# EAGLE design GCtoUSB_Current (EAGLE 6.2)
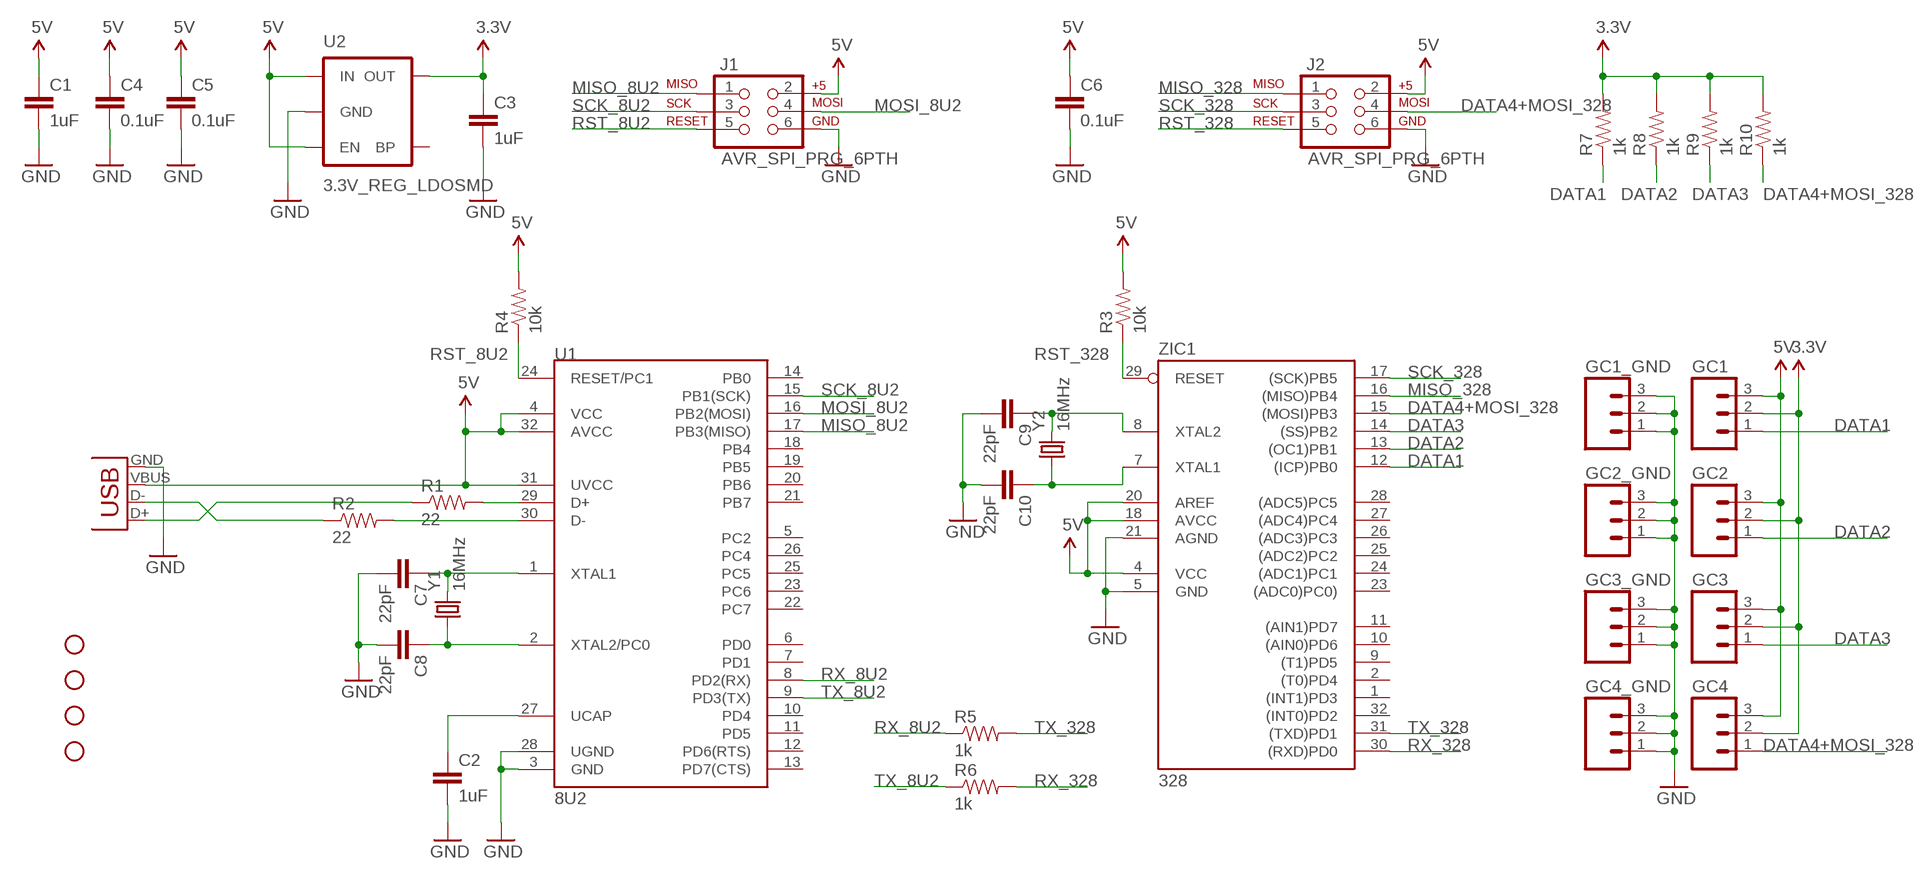
[diagram p0: schematic, sheet 1]

## Parts
C1  1uF  CAP0402-CAP  [0402-CAP]
C2  1uF  CAP0402-CAP  [0402-CAP]
C3  1uF  CAP0402-CAP  [0402-CAP]
C4  0.1uF  CAP0402-CAP  [0402-CAP]
C5  0.1uF  CAP0402-CAP  [0402-CAP]
C6  0.1uF  CAP0402-CAP  [0402-CAP]
C7  22pF  CAP0402-CAP  [0402-CAP]
C8  22pF  CAP0402-CAP  [0402-CAP]
C9  22pF  CAP0402-CAP  [0402-CAP]
C10  22pF  CAP0402-CAP  [0402-CAP]
GC1  M031X03_NO_SILK  [1X03_NO_SILK]
GC1_GND  M031X03_NO_SILK  [1X03_NO_SILK]
GC2  M031X03_NO_SILK  [1X03_NO_SILK]
GC2_GND  M031X03_NO_SILK  [1X03_NO_SILK]
GC3  M031X03_NO_SILK  [1X03_NO_SILK]
GC3_GND  M031X03_NO_SILK  [1X03_NO_SILK]
GC4  M031X03_NO_SILK  [1X03_NO_SILK]
GC4_GND  M031X03_NO_SILK  [1X03_NO_SILK]
J1  AVR_SPI_PRG_6PTH  [2X3]
J2  AVR_SPI_PRG_6PTH  [2X3]
JP5  STAND-OFF  [STAND-OFF]
JP6  STAND-OFF  [STAND-OFF]
JP7  STAND-OFF  [STAND-OFF]
JP8  STAND-OFF  [STAND-OFF]
R1  22  RESISTOR0603-RES  [0603-RES]
R2  22  RESISTOR0603-RES  [0603-RES]
R3  10k  RESISTOR0603-RES  [0603-RES]
R4  10k  RESISTOR0603-RES  [0603-RES]
R5  1k  RESISTOR0603-RES  [0603-RES]
R6  1k  RESISTOR0603-RES  [0603-RES]
R7  1k  RESISTOR0603-RES  [0603-RES]
R8  1k  RESISTOR0603-RES  [0603-RES]
R9  1k  RESISTOR0603-RES  [0603-RES]
R10  1k  RESISTOR0603-RES  [0603-RES]
U1  8U2  ATMEGA8U2AU  [TQFP32-08]
U2  3.3V_REG_LDOSMD  V_REG_LDOSMD  [SOT23-5]
X1  USB-MB-H  [USB-MB-H]
Y1  16MHz  CRYSTALHC49US  [HC49US]
Y2  16MHz  CRYSTALHC49US  [HC49US]
ZIC1  328  AT90S4433A  [TQFP32-08]

## Nets
3.3V: C3.1 GC1.2 GC2.2 GC3.2 GC4.2 R7.2 R8.2 R9.2 R10.2 U2.5(OUT)
5V: C1.1 C4.1 C5.1 C6.1 GC1.3 GC2.3 GC3.3 GC4.3 J1.2 J2.2 R3.2 R4.2 U1.4(VCC) U1.31(UVCC) U1.32(AVCC) U2.1(IN) U2.3(EN) X1.VBUS ZIC1.4(VCC) ZIC1.18(AVCC) ZIC1.20(AREF)
DATA1: GC1.1 R7.1 ZIC1.12((ICP)PB0)
DATA2: GC2.1 R8.1 ZIC1.13((OC1)PB1)
DATA3: GC3.1 R9.1 ZIC1.14((SS)PB2)
DATA4+MOSI_328: GC4.1 J2.4 R10.1 ZIC1.15((MOSI)PB3)
GND: C1.2 C2.2 C3.2 C4.2 C5.2 C6.2 C7.2 C8.2 C9.2 C10.2 GC1_GND.1 GC1_GND.2 GC1_GND.3 GC2_GND.1 GC2_GND.2 GC2_GND.3 GC3_GND.1 GC3_GND.2 GC3_GND.3 GC4_GND.1 GC4_GND.2 GC4_GND.3 J1.6 J2.6 U1.3(GND) U1.28(UGND) U2.2(GND) X1.GND ZIC1.5(GND) ZIC1.21(AGND)
MISO_8U2: J1.1 U1.17(PB3(MISO))
MISO_328: J2.1 ZIC1.16((MISO)PB4)
MOSI_8U2: J1.4 U1.16(PB2(MOSI))
N$1: C9.1 Y2.2 ZIC1.8(XTAL2)
N$2: C10.1 Y2.1 ZIC1.7(XTAL1)
N$3: R1.2 U1.29(D+)
N$4: R2.2 U1.30(D-)
N$5: R1.1 X1.D+
N$6: R2.1 X1.D-
N$8: C7.1 U1.1(XTAL1) Y1.2
N$9: C8.1 U1.2(XTAL2/PC0) Y1.1
N$12: C2.1 U1.27(UCAP)
RST_8U2: J1.5 R4.1 U1.24(RESET/PC1)
RST_328: J2.5 R3.1 ZIC1.29(RESET)
RX_8U2: R5.1 U1.8(PD2(RX))
RX_328: R6.2 ZIC1.30((RXD)PD0)
SCK_8U2: J1.3 U1.15(PB1(SCK))
SCK_328: J2.3 ZIC1.17((SCK)PB5)
TX_8U2: R6.1 U1.9(PD3(TX))
TX_328: R5.2 ZIC1.31((TXD)PD1)
Unconnected: U1.5(PC2) U1.6(PD0) U1.7(PD1) U1.10(PD4) U1.11(PD5) U1.12(PD6(RTS)) U1.13(PD7(CTS)) U1.14(PB0) U1.18(PB4) U1.19(PB5) U1.20(PB6) U1.21(PB7) U1.22(PC7) U1.23(PC6) U1.25(PC5) U1.26(PC4) U2.4(BP) ZIC1.1((INT1)PD3) ZIC1.2((T0)PD4) ZIC1.9((T1)PD5) ZIC1.10((AIN0)PD6) ZIC1.11((AIN1)PD7) ZIC1.23((ADC0)PC0)) ZIC1.24((ADC1)PC1) ZIC1.25((ADC2)PC2) ZIC1.26((ADC3)PC3) ZIC1.27((ADC4)PC4) ZIC1.28((ADC5)PC5) ZIC1.32((INT0)PD2)

## Library data of the parts
C1-C10 = SparkFun:CAP: Capacitor Standard 0603 ceramic capacitor, and 0.1" leaded capacitor.
GC1 GC1_GND GC2 GC2_GND GC3 GC3_GND GC4 GC4_GND = SparkFun:M03: Header 3 Standard 3-pin 0.1" header. Use with straight break away headers (SKU : PRT-00116), right angle break away headers (PRT-00553), swiss pins (PRT-00743), machine pins (PRT-00117), and female headers (PRT-00115). Molex polarized connector foot print use with SKU : PRT-08232 with associated crimp pins and housings.
J1 J2 = SparkFun:AVR_SPI_PRG_6: AVR ISP 6 Pin This is the reduced ISP connector for AVR programming. Common on Arduino. This footprint will take up less PCB space and can be used with a 10-pin to 6-pin adapter such as SKU: BOB-08508
JP5-JP8 = SparkFun:STAND-OFF: Stand Off This is the mechanical footprint for a #4 phillips button head screw. Use the keepout ring to avoid running the screw head into surrounding components. SKU : PRT-00447
R1-R10 = SparkFun:RESISTOR: Resistor Basic schematic elements and footprints for 0603, 1206, and PTH resistors.
U1 = SparkFun:ATMEGA8U2: Atmel 8-bit Microcontroller with 8/16/32K Bystes of ISP Flash and USB Controller. ATmega8U2, ATmega16U2, and ATmega32U2
U2 = SparkFun:V_REG_LDO: Voltage Regulator LDO Standard 150mA LDO voltage regulator in SOT-23 layout. Micrel part MIC5205. BP (by-pass) pin is used to lower output noise with 470pF cap.
X1 = SparkFun:USB: USB Connectors USB-B-PTH is fully proven SKU : PRT-00139 USB-miniB is fully proven SKU : PRT-00587 USB-A-PCB is untested. USB-A-H is throughly reviewed, but untested. Spark Fun Electronics SKU : PRT-00437 USB-B-SMT is throughly reviewed, but untested. Needs silkscreen touching up. USB-A-S has not been used/tested USB-MB-H has not been used/tested
Y1 Y2 = SparkFun:CRYSTAL: Crystals Various standard crystals. Proven footprints. Spark Fun Electronics SKU : COM-00534
ZIC1 = atmel:AT90S4433: MICROCONTROLLER 4 Kbytes FLASH 128 bytes SRAM 256 bytes EEPROM UART 6-channel 10 bit ADC

## Net classes
0 default: width 0.203 mm, clearance 0.203 mm

## Board
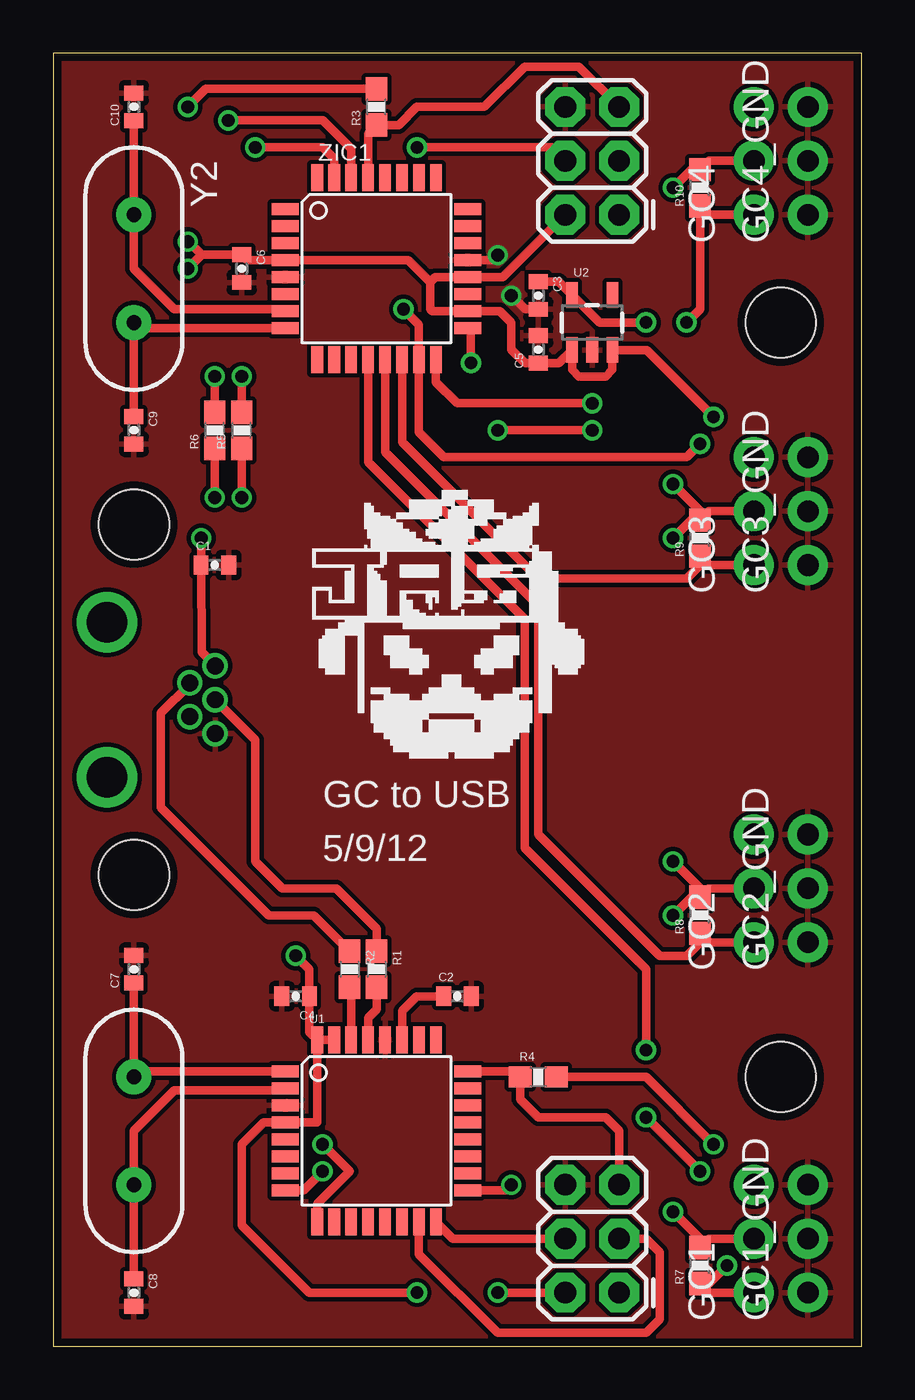
[diagram p1: board, top side]
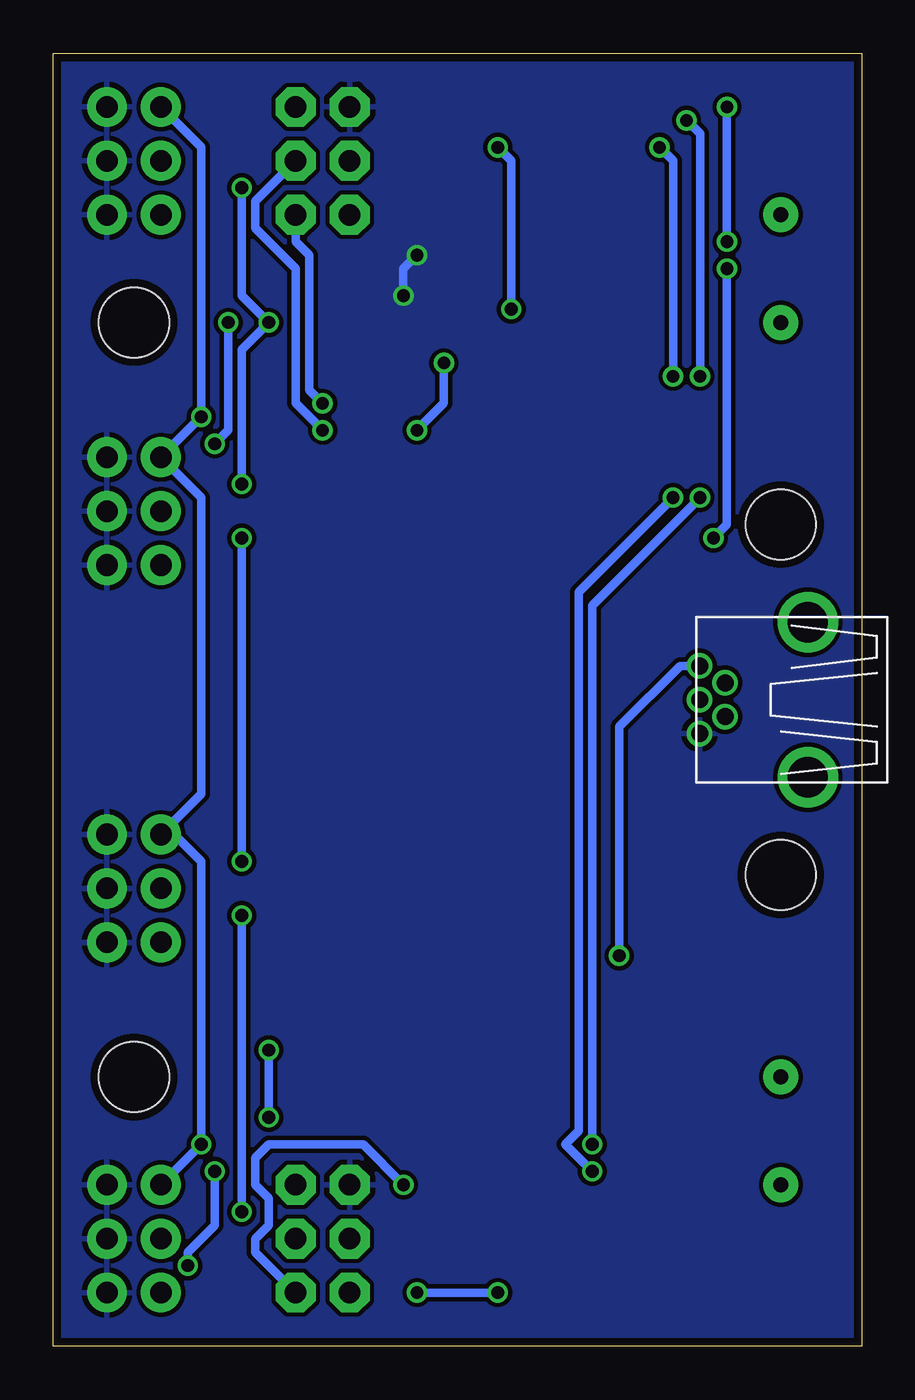
[diagram p2: board, bottom side, seen from below]

Size 38.1 x 60.96 mm. Coordinates in mm from the lower left corner, seen from the top.
Outline: 0,0 38.1,0 38.1,60.96 0,60.96 0,0
Copper layers (1*16): Top 0.0356mm / dielectric 1.5011mm / Bottom 0.0356mm
Design rules: minimum track width 6mil, minimum drill 13mil, track to track 6mil, track to pad 6mil, pad to pad 6mil, via to via 6mil, smd to smd 6mil, copper to edge 15mil, drill to drill 6mil, minimum pad ring 7mil, minimum via ring 7mil, stop-mask expansion 4mil, vias tented up to drill 0mil, thermal gap 10mil

### Footprints (pad centres in the part's own frame; a part is rotated, then mirrored left to right if it is on the bottom)
0402-CAP = smd 0.7 x 0.9: 1 -0.65,0; 2 0.65,0
1X03_NO_SILK = drill 1.016 pad 1.88: 1 0,0; 2 2.54,0; 3 5.08,0
2X3 = drill 1.016 pad 1.88 octagon: 1 0,0; 2 0,2.54; 3 2.54,0; 4 2.54,2.54; 5 5.08,0; 6 5.08,2.54
STAND-OFF = hole 3.302: 0,0
0603-RES = smd 1.1 x 1: 1 -0.85,0; 2 0.85,0
TQFP32-08 = smd 1.27 x 0.559: 1 -4.293,2.8; 2 -4.293,2; 3 -4.293,1.2; 4 -4.293,0.4; 5 -4.293,-0.4; 6 -4.293,-1.2; 7 -4.293,-2; 8 -4.293,-2.8; 17 4.293,-2.8; 18 4.293,-2; 19 4.293,-1.2; 20 4.293,-0.4; 21 4.293,0.4; 22 4.293,1.2; 23 4.293,2; 24 4.293,2.8 | smd 0.559 x 1.27: 9 -2.8,-4.293; 10 -2,-4.293; 11 -1.2,-4.293; 12 -0.4,-4.293; 13 0.4,-4.293; 14 1.2,-4.293; 15 2,-4.293; 16 2.8,-4.293; 25 2.8,4.293; 26 2,4.293; 27 1.2,4.293; 28 0.4,4.293; 29 -0.4,4.293; 30 -1.2,4.293; 31 -2,4.293; 32 -2.8,4.293
SOT23-5 = smd 0.55 x 1.2: 1 -0.95,-1.3; 2 0,-1.3; 3 0.95,-1.3; 4 0.95,1.3; 5 -0.95,1.3
USB-MB-H = drill 0.8: D+ 5.1,0; D- 3.9,0.8; GND 5.1,-1.6; ID 3.9,-0.8; VBUS 5.1,1.6 | drill 1.9: P$6 0,-3.65; P$7 0,3.65
HC49US = drill 0.7 pad 1.651: 1 -2.54,0; 2 2.54,0

### Placement (x,y rotation side)
C1  7.62,36.83 0 top
C2  19.05,16.51 0 top
C3  22.86,49.53 270 top
C4  11.43,16.51 180 top
C5  22.86,46.99 90 top
C6  8.89,50.8 270 top
C7  3.81,17.78 90 top
C8  3.81,2.54 270 top
C9  3.81,43.18 270 top
C10  3.81,58.42 90 top
GC1  33.02,2.54 90 top
GC1_GND  35.56,2.54 90 top
GC2  33.02,19.05 90 top
GC2_GND  35.56,19.05 90 top
GC3  33.02,36.83 90 top
GC3_GND  35.56,36.83 90 top
GC4  33.02,53.34 90 top
GC4_GND  35.56,53.34 90 top
J1  26.67,2.54 90 top
J2  26.67,53.34 90 top
JP5  3.81,38.73 0 top
JP6  34.29,12.7 0 top
JP7  3.81,22.23 0 top
JP8  34.29,48.26 0 top
R1  15.24,17.78 270 top
R2  13.97,17.78 270 top
R3  15.24,58.42 90 top
R4  22.86,12.7 0 top
R5  8.89,43.18 90 top
R6  7.62,43.18 90 top
R7  30.48,3.81 90 top
R8  30.48,20.32 90 top
R9  30.48,38.1 90 top
R10  30.48,54.61 90 top
U1  ATMEGA8U2AU  [TQFP32-08]  15.24,10.16 0 top
U2  25.4,48.26 0 top
X1  2.54,30.48 0 top
Y1  3.81,10.16 90 top
Y2  3.81,50.8 270 top
ZIC1  ATMEGA328  [TQFP32-08]  15.24,50.8 0 top

### Tracks (layer width: path | path; a pad name or v marks a point on that pad's centre or on a via)
3.3V  (via drill 0.6)
  Top 0.406: GC4.2 30.9,55.88 R10.2 30.06,55.46 v29.21,54.61 | GC3.2 30.9,39.37 R9.2 30.48,39.37 | GC2.2 30.9,21.59 R8.2 30.48,21.59 | GC1.2 30.9,5.08 R7.2 30.48,5.08 v29.21,6.35 | v27.94,48.26 25.75,48.26 U2.5 23.83,50.18 C3.1 | v29.21,40.64 30.48,39.37 | 30.48,39.37 v29.21,38.1 | v29.21,22.86 30.48,21.59 | 30.48,21.59 v29.21,20.32
  Bottom 0.406: v29.21,54.61 29.21,49.53 v27.94,48.26 29.21,46.99 v29.21,40.64 | v29.21,38.1 v29.21,22.86 | v29.21,20.32 v29.21,6.35
5V  (via drill 0.6)
  Top 0.406: 17.78,50.16 18.02,50.4 ZIC1.20 21.19,50.4 J2.2 | 17.78,50.16 17.78,48.9 17.88,48.8 ZIC1.18 21.05,48.8 21.59,48.26 21.59,46.99 22.24,46.34 C5.1 23.83,46.34 U2.1 24.45,46.03 24.77,45.72 26.04,45.72 26.35,46.03 U2.3 27.97,46.96 v31.11,43.81 | 17.78,50.16 16.75,51.2 ZIC1.4 9.14,51.2 C6.1 7,51.45 | 7,51.45 v6.35,50.8 | v6.99,38.1 6.99,36.84 C1.1 7,32.72 X1.VBUS | R3.2 7.2,59.27 v6.35,58.42 | v6.35,52.07 6.38,52.07 7,51.45 | U1.32 12.44,10.56 U1.4 9.93,10.56 8.89,9.53 8.89,5.71 12.06,2.54 v17.14,2.54 | U1.32 12.08,14.81 C4.1 12.06,16.52 12.06,17.78 v11.43,18.41 | U1.32 U1.31 | J1.2 v20.95,2.54 | R4.2 27.94,12.7 v31.11,9.53
  Bottom 0.406: v6.35,50.8 6.35,38.73 v6.99,38.1 | v6.35,58.42 v6.35,52.07 | GC1.3 v31.11,9.53 31.11,22.86 32.38,24.13 GC2.3 31.11,26.04 31.11,40.01 GC3.3 v31.11,43.81 31.11,56.52 GC4.3 | v11.43,18.41 11.43,29.21 8.56,32.08 X1.VBUS | v20.95,2.54 v17.14,2.54
DATA1  (via drill 0.6)
  Top 0.406: GC1.1 30.9,2.54 R7.1 30.9,2.96 v31.75,3.81 | v30.48,8.26 v27.94,10.79 | ZIC1.12 14.84,41.67 22.23,34.29 22.23,23.5 27.94,17.78 v27.94,13.97
  Bottom 0.406: v31.75,3.81 31.75,4.45 30.48,5.71 v30.48,8.26 | v27.94,10.79 v27.94,13.97
DATA2
  Top 0.406: GC2.1 30.9,19.05 R8.1 30.48,19.05 29.84,18.41 28.57,18.41 22.86,24.13 22.86,34.92 15.64,42.15 ZIC1.13
DATA3
  Top 0.406: GC3.1 30.9,36.83 R9.1 30.48,36.83 29.84,36.2 22.86,36.2 16.44,42.62 ZIC1.14
DATA4+MOSI_328  (via drill 0.6)
  Top 0.406: GC4.1 30.9,53.34 R10.1 30.48,48.9 v29.84,48.26 | v16.51,48.9 17.24,48.16 ZIC1.15 17.24,43.09 18.41,41.91 29.84,41.91 v30.48,42.55 | v17.14,56.52 23.5,56.52 J2.4
  Bottom 0.406: v16.51,48.9 16.51,55.88 v17.14,56.52 | v29.84,48.26 29.84,43.18 v30.48,42.55
GND  (via drill 0.6)
  Top 0.406: C3.2 22.24,48.88 v21.59,49.53 | ZIC1.21 20.72,51.2 v20.95,51.44
  Bottom 0.406: v21.59,49.53 21.59,50.8 v20.95,51.44
  pour Top: 0,0 0,60.96 38.1,60.96 38.1,0
  pour Bottom: 0,0 0,60.96 38.1,60.96 38.1,0
MISO_8U2  (via drill 0.6)
  Top 0.406: U1.17 21.33,7.36 v21.59,7.62
  Bottom 0.406: J1.1 28.57,4.45 28.57,5.08 27.94,5.71 27.94,6.99 28.57,7.62 28.57,8.89 27.94,9.53 23.5,9.53 v21.59,7.62
MISO_328  (via drill 0.6)
  Top 0.406: ZIC1.16 18.04,45.46 19.05,44.45 v25.4,44.45
  Bottom 0.406: J2.1 26.67,52.07 26.04,51.44 26.04,45.09 v25.4,44.45
MOSI_8U2
  Top 0.406: J1.4 18.83,5.08 U1.16
N$1
  Top 0.406: C9.1 Y2.2 4.07,48 ZIC1.8
N$2
  Top 0.406: C10.1 Y2.1 3.81,50.8 5.71,48.9 10.85,48.9 ZIC1.7
N$3
  Top 0.406: U1.29 14.84,15.47 15.24,15.88 R1.2
N$4
  Top 0.406: U1.30 14.04,16.86 R2.2
N$5
  Top 0.406: X1.D+ 7.64,30.46 9.53,28.57 9.53,22.86 10.79,21.59 13.34,21.59 15.24,19.68 R1.1
N$6
  Top 0.406: R2.1 12.28,20.32 10.16,20.32 5.08,25.4 5.08,29.84 6.44,31.2 X1.D-
N$8
  Top 0.406: C7.1 Y1.2 4.07,12.96 U1.1
N$9
  Top 0.406: C8.1 Y1.1 3.81,10.16 5.71,12.06 10.85,12.06 U1.2
N$12
  Top 0.406: U1.27 16.44,15.8 17.14,16.51 C2.1
RST_8U2
  Top 0.406: U1.24 21.75,12.96 R4.1 22.01,11.64 22.86,10.79 26.04,10.79 26.67,10.16 J1.5
RST_328
  Top 0.406: ZIC1.29 14.84,57.17 R3.1 16.3,57.57 17.14,58.42 20.32,58.42 22.23,60.33 24.77,60.33 J2.5
RX_8U2  (via drill 0.6)
  Top 0.406: U1.8 11.8,7.36 v12.7,8.26 | v8.89,40.01 R5.1
  Bottom 0.406: v12.7,8.26 13.97,9.53 13.34,10.16 13.34,35.56 v8.89,40.01
RX_328  (via drill 0.6)
  Top 0.406: R6.2 v7.62,45.72 | ZIC1.30 14.04,56.45 12.7,57.78 v8.26,57.78
  Bottom 0.406: v7.62,45.72 7.62,57.15 v8.26,57.78
SCK_8U2
  Top 0.406: U1.15 17.24,4.35 20.95,0.64 27.94,0.64 28.57,1.27 28.57,4.45 27.94,5.08 J1.3
SCK_328  (via drill 0.6)
  Top 0.406: v25.4,43.18 v20.95,43.18 | v19.68,46.35 19.68,47.85 ZIC1.17
  Bottom 0.406: J2.3 28.57,53.98 28.57,52.7 26.67,50.8 26.67,44.45 v25.4,43.18 | v20.95,43.18 19.68,44.45 v19.68,46.35
TX_8U2  (via drill 0.6)
  Top 0.406: U1.9 12.44,6.72 13.97,8.26 v12.7,9.53 | v7.62,40.01 R6.1
  Bottom 0.406: v12.7,9.53 12.7,34.92 v7.62,40.01
TX_328  (via drill 0.6)
  Top 0.406: R5.2 v8.89,45.72 | ZIC1.31 13.24,55.98 12.7,56.52 v9.53,56.52
  Bottom 0.406: v8.89,45.72 8.89,55.88 v9.53,56.52

### Text on the board
tPlace: GC to USB | 5/9/12